# Altium schematic sheet input_signal_conditioning.SchDoc
size A4; SheetNumber: 3; SheetTotal: 6
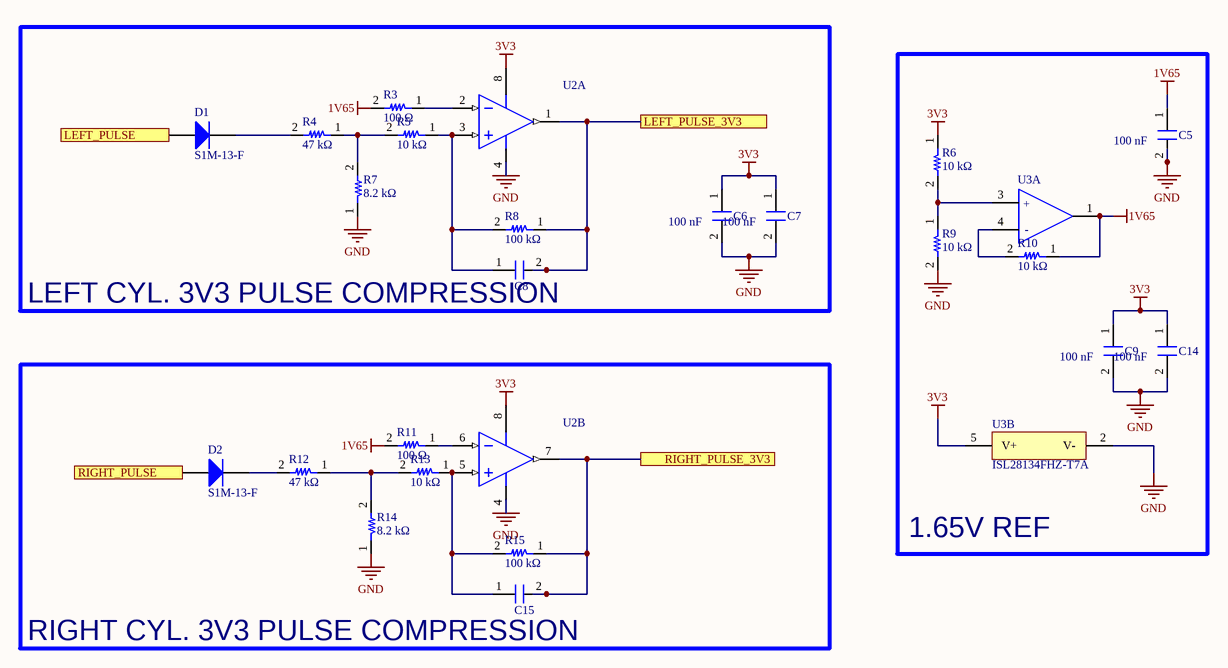
[diagram p0: input_signal_conditioning.SchDoc]

## Parts
C5  value 100 nF  [0402_fp]  (hidden comment: Capacitor_0402)
C6  value 100 nF  [0402_fp]  (hidden comment: Capacitor_0402)
C7  value 100 nF  [0402_fp]  (hidden comment: Capacitor_0402)
C8  Capacitor_0402  [0402_fp]  (value not drawn)
C9  value 100 nF  [0402_fp]  (hidden comment: Capacitor_0402)
C14  value 100 nF  [0402_fp]  (hidden comment: Capacitor_0402)
C15  Capacitor_0402  [0402_fp]  (value not drawn)
D1  S1M-13-F  [DIOD-S1M-13-F-SMA-2_V]
D2  S1M-13-F  [DIOD-S1M-13-F-SMA-2_V]
R3  value 100 Ω  [0402_fp]  (hidden comment: Resistor_0402)
R4  value 47 kΩ  [0402_fp]  (hidden comment: Resistor_0402)
R5  value 10 kΩ  [0402_fp]  (hidden comment: Resistor_0402)
R6  value 10 kΩ  [0402_fp]  (hidden comment: Resistor_0402)
R7  value 8.2 kΩ  [0402_fp]  (hidden comment: Resistor_0402)
R8  value 100 kΩ  [0402_fp]  (hidden comment: Resistor_0402)
R9  value 10 kΩ  [0402_fp]  (hidden comment: Resistor_0402)
R10  value 10 kΩ  [0402_fp]  (hidden comment: Resistor_0402)
R11  value 100 Ω  [0402_fp]  (hidden comment: Resistor_0402)
R12  value 47 kΩ  [0402_fp]  (hidden comment: Resistor_0402)
R13  value 10 kΩ  [0402_fp]  (hidden comment: Resistor_0402)
R14  value 8.2 kΩ  [0402_fp]  (hidden comment: Resistor_0402)
R15  value 100 kΩ  [0402_fp]  (hidden comment: Resistor_0402)
U2  LM358MX  [D0008A_M]  (value not drawn)  (parts A,B of 2)
U3  ISL28134FHZ-T7A  [P5_064A_MFG]  (value not drawn)  (parts A,B of 2)

## Blocks framed on the sheet
LEFT CYL. 3V3 PULSE COMPRESSION: C6-C8 D1 R3-R5 R7 R8 U2
1.65V REF: C5 C9 C14 R6 R9 R10 U3
RIGHT CYL. 3V3 PULSE COMPRESSION: C15 D2 R11-R15 U2

## Ports
LEFT_PULSE (see input_output[3A]), LEFT_PULSE_3V3 (see logic[1D], logic[3A]), RIGHT_PULSE (see input_output[3A]), RIGHT_PULSE_3V3 (see logic[1D], logic[3A])

## Nets
1V65: C5.1 R3.2 R10.1 R11.2 U3.1(OUT)
3V3: C6.1 C7.1 C9.1 C14.1 R6.1 U2.8(V+) U3.5(V+)
GND: C5.2 C6.2 C7.2 C9.2 C14.2 R7.1 R9.2 R14.1 U2.4(GND) U3.2(V-)
LEFT_PULSE: D1.1(A) ; port LEFT_PULSE
LEFT_PULSE_3V3: C8.2 R8.1 U2.1(OUTA) ; port LEFT_PULSE_3V3
RIGHT_PULSE: D2.1(A) ; port RIGHT_PULSE
RIGHT_PULSE_3V3: C15.2 R15.1 U2.7(OUTB) ; port RIGHT_PULSE_3V3
NetC8_1: C8.1 R5.1 R8.2 U2.3(INA+)
NetC15_1: C15.1 R13.1 R15.2 U2.5(INB+)
NetD1_2: D1.2(K) R4.2
NetD2_2: D2.2(K) R12.2
NetR3_1: R3.1 U2.2(INA-)
NetR4_1: R4.1 R5.2 R7.2
NetR6_2: R6.2 R9.1 U3.3(IN+)
NetR10_2: R10.2 U3.4(IN-)
NetR11_1: R11.1 U2.6(INB-)
NetR12_1: R12.1 R13.2 R14.2

## Notes on the sheet
- (in symbol CMP-00572-88252605-3, part A) +; -

## Library data of the parts
C5-C7 C9 C14 = Capacitor_0402: Format: 0402; Package: 0402
C8 C15 = Capacitor_0402: Value: 3.3 nF; Format: 0402; Package: 0402
D1 D2 = CMP-0639-00001-1: Surface Mount Glass Passivated Rectifier, 1000V, 1 A, -65 to 125 degC, 2-Pin SMA Package, RoHS, Tape and Reel; Manufacturer: Diodes Inc; Maximum Reverse Current IR (uA): 5; Maximum Peak Forward Surge Current IFSM (A): 30; Maximum Average Rectified Current IO (A): 1; Peak Repetitive Reverse Voltage VRRM (V): 1000; Total Capacitance CT (pF): 10; Forward Voltage Drop VF (V): 1.1; ComponentLink1URL: http://www.diodes.com/; Operating Temperature Range: -65 to 150 degC; ComponentLink3URL: http://diodes.com/datasheets/ds16003.pdf; ComponentLink3Description: Package Specification; PackageDescription: 2-Pin SMD, Body 4.3 x 2.605 mm, Height 2.3 mm; Mounting Technology: Surface Mount; ComponentLink1Description: Manufacturer URL; PackageReference: S1M-13-F-SMA-2; ComponentLink2URL: http://diodes.com/datasheets/ds16003.pdf; ComponentLink2Description: Datasheet; RoHS: TRUE; DatasheetVersion: Rev. 22 - 2; Packing: Tape and Reel; PackageVersion: Rev. 22 - 2; PartNumber: S1M-13-F
U2 = CMP-0055-00630-3: Low Power Dual Operational Amplifier, 8-pin Narrow SOIC; Manufacturer: Texas Instruments; PowerWise: N; PackageTopMarking: NSZXTT*LM*358M; CompType: Amplifiers; ComponentLink1URL: http://www.ti.com/general/docs/lit/getliterature.tsp?genericPartNumber=LM358-N&fileType=pdf; PinCount: 8; PackageDescription: SOIC Narrow, 4.9 x 3.9 x 1.45mm, 8 Lead, 1.27mm Pitch; Code_IPC: SOIC127P600-8; RoHS: N; Code_JEDEC: MS-012-AA; Package Reference: D0008A; ComponentLink1Description: Datasheet URL
U3 = CMP-00572-88252605-3: 5V Ultra Low Noise, Zero Drift Rail-to-Rail Precision Op Amp; Manufacturer Lifecycle Status: ACTIVE; Slew Rate: 1.5V/µs; Min Dual Supply Voltage: 1.125V; Bandwidth: 3.5MHz; Operating Supply Current: 675µA; Output Current per Channel: 65mA; Power Supply Rejection Ratio (PSRR): 135dB; Input Offset Voltage (Vos): -200nV; RAM Size: 384kB; Voltage Gain: 174dB; Number of Channels: 1; Pitch: 1mm; Max Supply Voltage: 6V; Input Bias Current: 120pA; Min Supply Voltage: 2.25V; Max Dual Supply Voltage: 3V; Supply Type: Dual, Single; Radiation Hardening: No; Min Operating Temperature: -40°C; ComponentLink1URL: http://www.renesas.com; ComponentLink3URL: https://www.renesas.com/en/document/psc/package-drawing-sot23-5pin-p5064a; Number of Pins: 5; Length: 2.9mm; Contact Plating: Tin; ComponentLink2URL: https://octopart.com/cad-content/api/get-model-datasheet/15189/88252605; Export Control Classification Number (ECCN) Code: EAR99; ComponentLink1Description: Manufacturer's Website; Gain Bandwidth Product: 3.5MHz; HelpURL: https://octopart.com/cad-content/api/get-model-datasheet/15189/88252605; ComponentLink3Description: Manufacturer's Package Drawing; RoHS: Compliant; Case/Package: SOT-23; Common Mode Rejection Ratio: 135dB; Lead Free: Lead Free; Output Current: 65mA; Width: 1.6mm; Nominal Supply Current: 675µA; Lifecycle Status: Production; Mount: Surface Mount; ComponentLink2Description: Datasheet URL; Max Operating Temperature: 125°C; Height: 0m; Number of Circuits: 1
R3-R15 = Resistor_0402: Package: 0402